# EAGLE design OneButton (EAGLE 8.5.2)
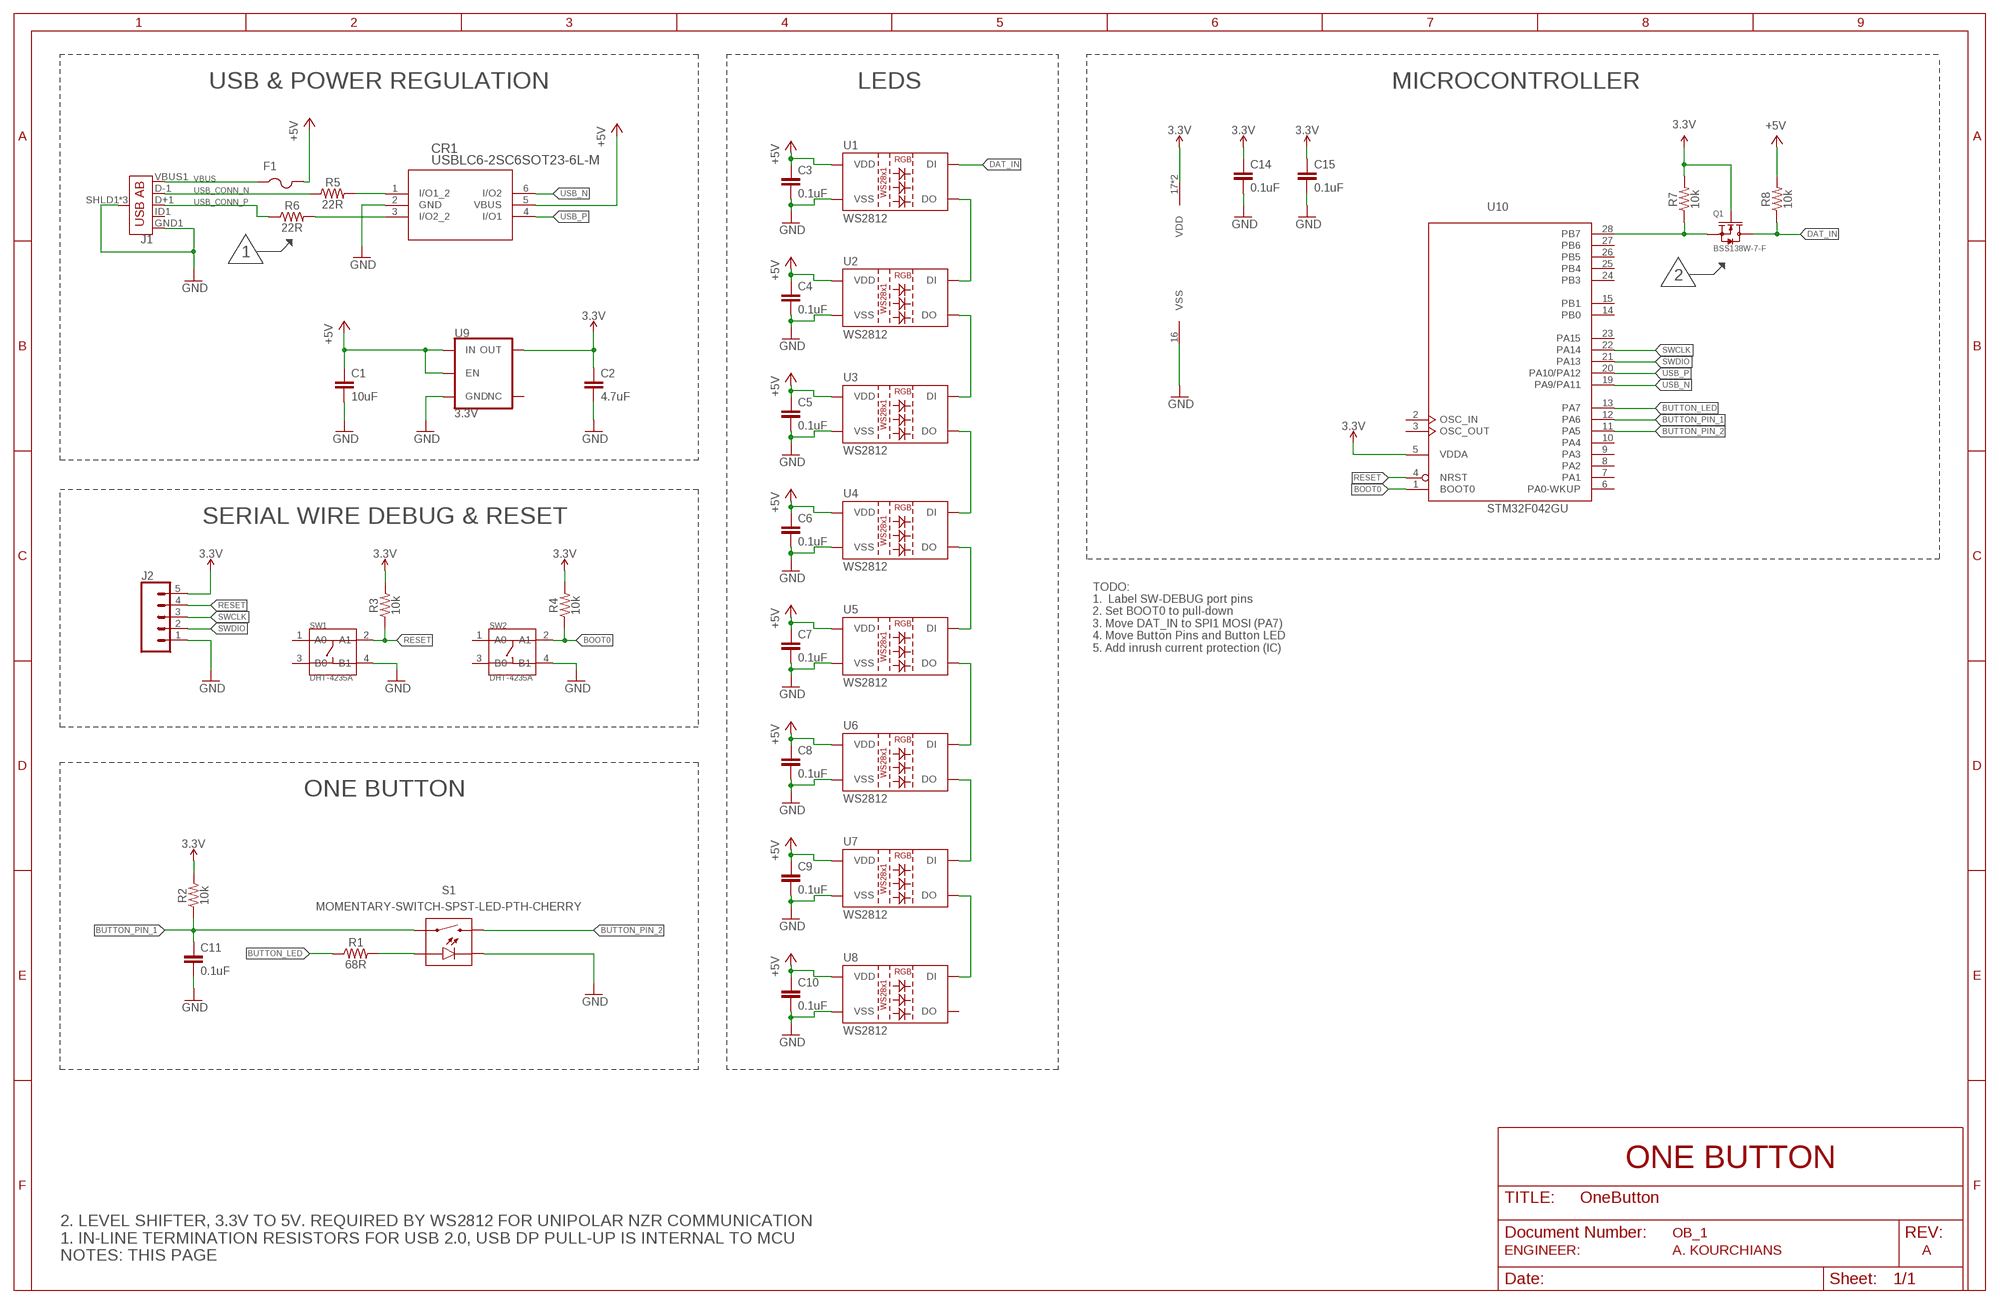
[diagram p0: schematic, sheet 1]

## Parts
C1  10uF  10UFCAP-1206  [CAP-1206]
C2  4.7uF  4.7UFCAP-1206  [CAP-1206]
C3  0.1uF  0.1UFCAP-0603  [CAP-0603]
C4  0.1uF  0.1UFCAP-0603  [CAP-0603]
C5  0.1uF  0.1UFCAP-0603  [CAP-0603]
C6  0.1uF  0.1UFCAP-0603  [CAP-0603]
C7  0.1uF  0.1UFCAP-0603  [CAP-0603]
C8  0.1uF  0.1UFCAP-0603  [CAP-0603]
C9  0.1uF  0.1UFCAP-0603  [CAP-0603]
C10  0.1uF  0.1UFCAP-0603  [CAP-0603]
C11  0.1uF  CAPACITORCAP-0603  [CAP-0603]
C14  0.1uF  0.1UFCAP-0603  [CAP-0603]
C15  0.1uF  0.1UFCAP-0603  [CAP-0603]
CR1  USBLC6-2SC6SOT23-6L-M  [SOT23-6L-M]
F1  PTCFUSE-1206  [R1206]
J1  USB_AB_SMT  [USB-AB-MICRO-SMD]
J2  CONN_05  [1X05]
Q1  BSS138W-7-F  SMD-MOSFET-N-CH-50V-200MA-BSS138W-7-F(SOT-23)  [SOT-23]
R1  68R  RESISTORRES-0603  [RESC0603_N]
R2  10k  RESISTORRES-0603  [RESC0603_N]
R3  10k  RESISTORRES-0603  [RESC0603_N]
R4  10k  RESISTORRES-0603  [RESC0603_N]
R5  22R  RESISTORRES-0603  [RESC0603_N]
R6  22R  RESISTORRES-0603  [RESC0603_N]
R7  10k  RESISTORRES-0603  [RESC0603_N]
R8  10k  RESISTORRES-0603  [RESC0603_N]
S1  MOMENTARY-SWITCH-SPST-LED-PTH-CHERRY  [CHERRY-MX-LED]
SW1  DHT-4235A  SMD-BUTTON-TOP-DHT-4235A(4P-4.2X3.2MM)  [SW4-SMD-4.2X3.2X2.5MM]
SW2  DHT-4235A  SMD-BUTTON-TOP-DHT-4235A(4P-4.2X3.2MM)  [SW4-SMD-4.2X3.2X2.5MM]
U1  WS2812  WS2812"  [LED-TRICOLOR-5050-IC]
U2  WS2812  WS2812"  [LED-TRICOLOR-5050-IC]
U3  WS2812  WS2812"  [LED-TRICOLOR-5050-IC]
U4  WS2812  WS2812"  [LED-TRICOLOR-5050-IC]
U5  WS2812  WS2812"  [LED-TRICOLOR-5050-IC]
U6  WS2812  WS2812"  [LED-TRICOLOR-5050-IC]
U7  WS2812  WS2812"  [LED-TRICOLOR-5050-IC]
U8  WS2812  WS2812"  [LED-TRICOLOR-5050-IC]
U9  3.3V  V_REG_AP2112K-3.3V  [SOT23-5]
U10  STM32F042GU  [UFQFPN28]

## Nets
3.3V: C2.1 C14.1 C15.1 J2.5 Q1.1(G) R2.2 R3.2 R4.2 R7.2 U9.5(OUT) U10.5(VDDA) U10.17(VDD) U10.18(VDD)
+5V: C1.1 C3.1 C4.1 C5.1 C6.1 C7.1 C8.1 C9.1 C10.1 CR1.5(VBUS) F1.2 R8.2 U1.3(VDD) U1.5(VDD) U2.3(VDD) U2.5(VDD) U3.3(VDD) U3.5(VDD) U4.3(VDD) U4.5(VDD) U5.3(VDD) U5.5(VDD) U6.3(VDD) U6.5(VDD) U7.3(VDD) U7.5(VDD) U8.3(VDD) U8.5(VDD) U9.1(IN) U9.3(EN)
BOOT0: R4.1 SW2.2(A1) U10.1(BOOT0)
BUTTON_LED: R1.1 U10.13(PA7)
BUTTON_PIN_1: C11.1 R2.1 S1.S1 U10.12(PA6)
BUTTON_PIN_2: S1.S2 U10.11(PA5)
DAT_IN: Q1.3(D) R8.1 U1.2(DI)
GND: C1.2 C2.2 C3.2 C4.2 C5.2 C6.2 C7.2 C8.2 C9.2 C10.2 C11.2 C14.2 C15.2 CR1.2(GND) J1.GND1(GND) J1.SHLD1(SHIELD) J1.SHLD2(SHIELD) J1.SHLD3(SHIELD) J2.1 S1.K1(C) S1.K(C) SW1.4(B1) SW2.4(B1) U1.6(VSS) U2.6(VSS) U3.6(VSS) U4.6(VSS) U5.6(VSS) U6.6(VSS) U7.6(VSS) U8.6(VSS) U9.2(GND) U10.16(VSS)
N$2: Q1.2(S) R7.1 U10.28(PB7)
N$6: R1.2 S1.A S1.A1(A)
N$9: U1.1(DO) U2.2(DI)
N$10: U2.1(DO) U3.2(DI)
N$11: U3.1(DO) U4.2(DI)
N$12: U4.1(DO) U5.2(DI)
N$13: U5.1(DO) U6.2(DI)
N$14: U6.1(DO) U7.2(DI)
N$15: U7.1(DO) U8.2(DI)
RESET: J2.4 R3.1 SW1.2(A1) U10.4(NRST)
SWCLK: J2.3 U10.22(PA14)
SWDIO: J2.2 U10.21(PA13)
USB_CONN_N: J1.D-1(D-) R5.1
USB_CONN_P: J1.D+1(D+) R6.1
USB_N: CR1.6(I/O2) U10.19(PA9/PA11)
USB_P: CR1.4(I/O1) U10.20(PA10/PA12)
USB_R_N: CR1.1(I/O1_2) R5.2
USB_R_P: CR1.3(I/O2_2) R6.2
VBUS: F1.1 J1.VBUS1(VBUS)
Unconnected: J1.ID1(USBID) SW1.1(A0) SW1.3(B0) SW2.1(A0) SW2.3(B0) U8.1(DO) U9.4(NC) U10.2(OSC_IN) U10.3(OSC_OUT) U10.6(PA0-WKUP) U10.7(PA1) U10.8(PA2) U10.9(PA3) U10.10(PA4) U10.14(PB0) U10.15(PB1) U10.23(PA15) U10.24(PB3) U10.25(PB4) U10.26(PB5) U10.27(PB6)

## Notes on the sheet
- USB & POWER REGULATION | LEDS | MICROCONTROLLER
- 1
- 2
- SERIAL WIRE DEBUG & RESET
- TODO:
  1.  Label SW-DEBUG port pins
  2. Set BOOT0 to pull-down
  3. Move DAT_IN to SPI1 MOSI (PA7)
  4. Move Button Pins and Button LED
  5. Add inrush current protection (IC)
- ONE BUTTON
- ONE BUTTON
- OB_1
- ENGINEER:                       A. KOURCHIANS | A
- 2. LEVEL SHIFTER, 3.3V TO 5V. REQUIRED BY WS2812 FOR UNIPOLAR NZR COMMUNICATION
  1. IN-LINE TERMINATION RESISTORS FOR USB 2.0, USB DP PULL-UP IS INTERNAL TO MCU
  NOTES: THIS PAGE

## Library data of the parts
C1 = OneButton:10UF: 10.0µF ceramic capacitors A capacitor is a passive two-terminal electrical component used to store electrical energy temporarily in an electric field.; MPN: CL31B106KAHNNNE
C2 = OneButton:4.7UF: 4.7µF ceramic capacitors A capacitor is a passive two-terminal electrical component used to store electrical energy temporarily in an electric field.; MPN: C3216X7R1C475K160AB
C3-C10 C14 C15 = OneButton:0.1UF: 0.1µF ceramic capacitors A capacitor is a passive two-terminal electrical component used to store electrical energy temporarily in an electric field.; MPN: C0603C104K8RACTU
C11 = OneButton:CAPACITOR: Generic chip capacitor
CR1 = OneButton:USBLC6-2SC6; MPN: USBLC62SC6; VENDOR: ST Microelectronics
F1 = OneButton:PTCFUSE: PTC fuses, resettable thermistors; MPN: 0ZCJ0075AF2E
J1 = OneButton:USB_AB: USB Type AB Micro Connector OTG-compatible. 5 pins, 3 shield pins SparkFun Products: IOIO-OTG <https://www.sparkfun.com/products/13613> SparkFun SAMD21 Mini Breakout <https://www.sparkfun.com/products/13664>; MPN: 10118192-0001LF; PROD_ID: CONN-11794
J2 = OneButton:CONN_05: Multi connection point. Often used as Generic Header-pin footprint for 0.1 inch spaced/style header connections On any of the 0.1 inch spaced packages, you can populate with these: Break Away Headers - Straight <https://www.sparkfun.com/products/116> (PRT-00116) Break Away Male Headers - Right Angle <https://www.sparkfun.com/products/553> (PRT-00553) Female Headers <https://www.sparkfun.com/products/115> (PRT-00115) Break Away Headers - Machine Pin <https://www.sparkfun.com/products/117> (PRT-00117) Break Away Female Headers - Swiss Machine Pin <https://www.sparkfun.com/products/743> (PRT-00743) For SCREWTERMINALS and SPRING TERMINALS visit here: Screw Terimnals on SparkFun.com <https://www.sparkfun.com/search/results?term=Screw+Terminals> (5mm/3.5mm/2.54mm spacing) This device is also useful as a general connection point to wire up your design to another part of your project. Our various solder wires solder well into these plated through hole pads. Hook-Up Wire - Assortment (Stranded, 22 AWG) <https://www.sparkfun.com/products/11375> (PRT-11375) Hook-Up Wire - Assortment (Solid Core, 22 AWG) <https://www.sparkfun.com/products/11367> (PRT-11367) View the entire wire category on our website here <https://www.sparkfun.com/categories/141> Special notes: Molex polarized connector foot print use with SKU : PRT-08231 with associated crimp pins and housings. 1MM SMD Version SKU: PRT-10208; MPN: 61300511121
Q1 = OneButton:SMD-MOSFET-N-CH-50V-200MA-BSS138W-7-F(SOT-23): SMD-MOSFET-N-CH 305030000; MPN: BSS138LT1G
R1-R8 = OneButton:RESISTOR: Generic Resistor Package
S1 = OneButton:MOMENTARY-SWITCH-SPST-LED: Momentary Switch (Pushbutton) - SPST - w/ LED Normally-open (NO) SPST momentary switches (buttons, pushbuttons), with a built-in LED. Variants PTH-CHERRY - Cherry MX Switch Cherry MX Keyswitches are top-of-the-line mechanical keyboard switches. They’re satisfyingly “clicky”, reliable up to tens-of-millions of key presses, and a standard in gaming and programming keyboards across the globe. This ‘blue’ version Cherry MX Switch is favored by most due to its secondary internal actuator making it less likely to “double-tap.” If you are looking for a noticeably audible and high-quality key switch, this is the perfect option for you! Cherry MX Switch <https://www.sparkfun.com/products/13834> (COM-13834) Cherry MX Switch Breakout <https://www.sparkfun.com/products/13773> (BOB-13773) PTH-12MM and PTH-12MM-KIT - 12mm Illuminated LED KIT variant is for soldering kits. There is no tStop (covering up the top side of the pads with mask). This helps the beginner see which side they should be soldering too. LED Tactile Button Breakout <https://www.sparkfun.com/products/10467> (BOB-10467) LED Tactile Button - Red <https://www.sparkfun.com/products/10442> (COM-10442) LED Tactile Button - Blue <https://www.sparkfun.com/products/10443> (COM-10443) LED Tactile Button - Green <https://www.sparkfun.com/products/10440> (COM-10440) LED Tactile Button - Orange <https://www.sparkfun.com/products/10441> (COM-10441) LED Tactile Button - White <https://www.sparkfun.com/products/10439> (COM-10439); MPN: MX1A-E1NW; SF_ID: COM-13834; SPICEPREFIX: S
SW1 SW2 = OneButton:SMD-BUTTON-TOP-DHT-4235A(4P-4.2X3.2MM): 311020045; MPN: PTS810 SJK 250 SMTR LFS
U1-U8 = OneButton:WS2812: WS2812 RGB LED w/ WS2811 driver 5x5mm SMD LED with built-in controller IC. Color: Red/Green/Blue mC Rating: RGB: 550, 1100, 200 mcd Current:RGB: 20, 20, 20 mA Forward Voltage: RGB: 1.8, 3.0, 3.2 V Packages:LED-TRICOLOR-5050-IC SparkFun Products: LED-SMD RGB (WS2812) <https://www.sparkfun.com/products/11821>; MPN: WS2812; PROD_ID: DIO-11598
U9 = OneButton:V_REG_AP2112: AP2112 - 600mA CMOS LDO Regulator w/ Enable The AP2112 is CMOS process low dropout linear regulator with enable function, the regulator delivers a guaranteed 600mA (min.) continuous load current. Features Output Voltage Accuracy: ±1.5% Output Current: 600mA (Min.) Foldback Short Current Protection: 50mA Enable Function to Turn ON/OFF VOUT Low Dropout Voltage (3.3V): 250mV (Typ.) @IOUT=600mA Excellent Load Regulation: 0.2%/A (Typ.) Excellent Line Regulation: 0.02%/V (Typ.) Low Quiescent Current: 55μA (Typ.) Low Standby Current: 0.01μA (Typ.) Low Output Noise: 50μVRMS PSRR: 100Hz -65dB, 1kHz -65dB OTSD Protection Stable with 1.0μF Flexible Cap: Ceramic, Tantalum and Aluminum Electrolytic Operation Temperature Range: -40°C to 85°C ESD: MM 400V, HBM 4000V; MPN: AP2112K-3.3TRG1; PROD_ID: VREG-12457
U10 = OneButton:STM32F042G*U; MPN: STM32F042G6U6

## Board
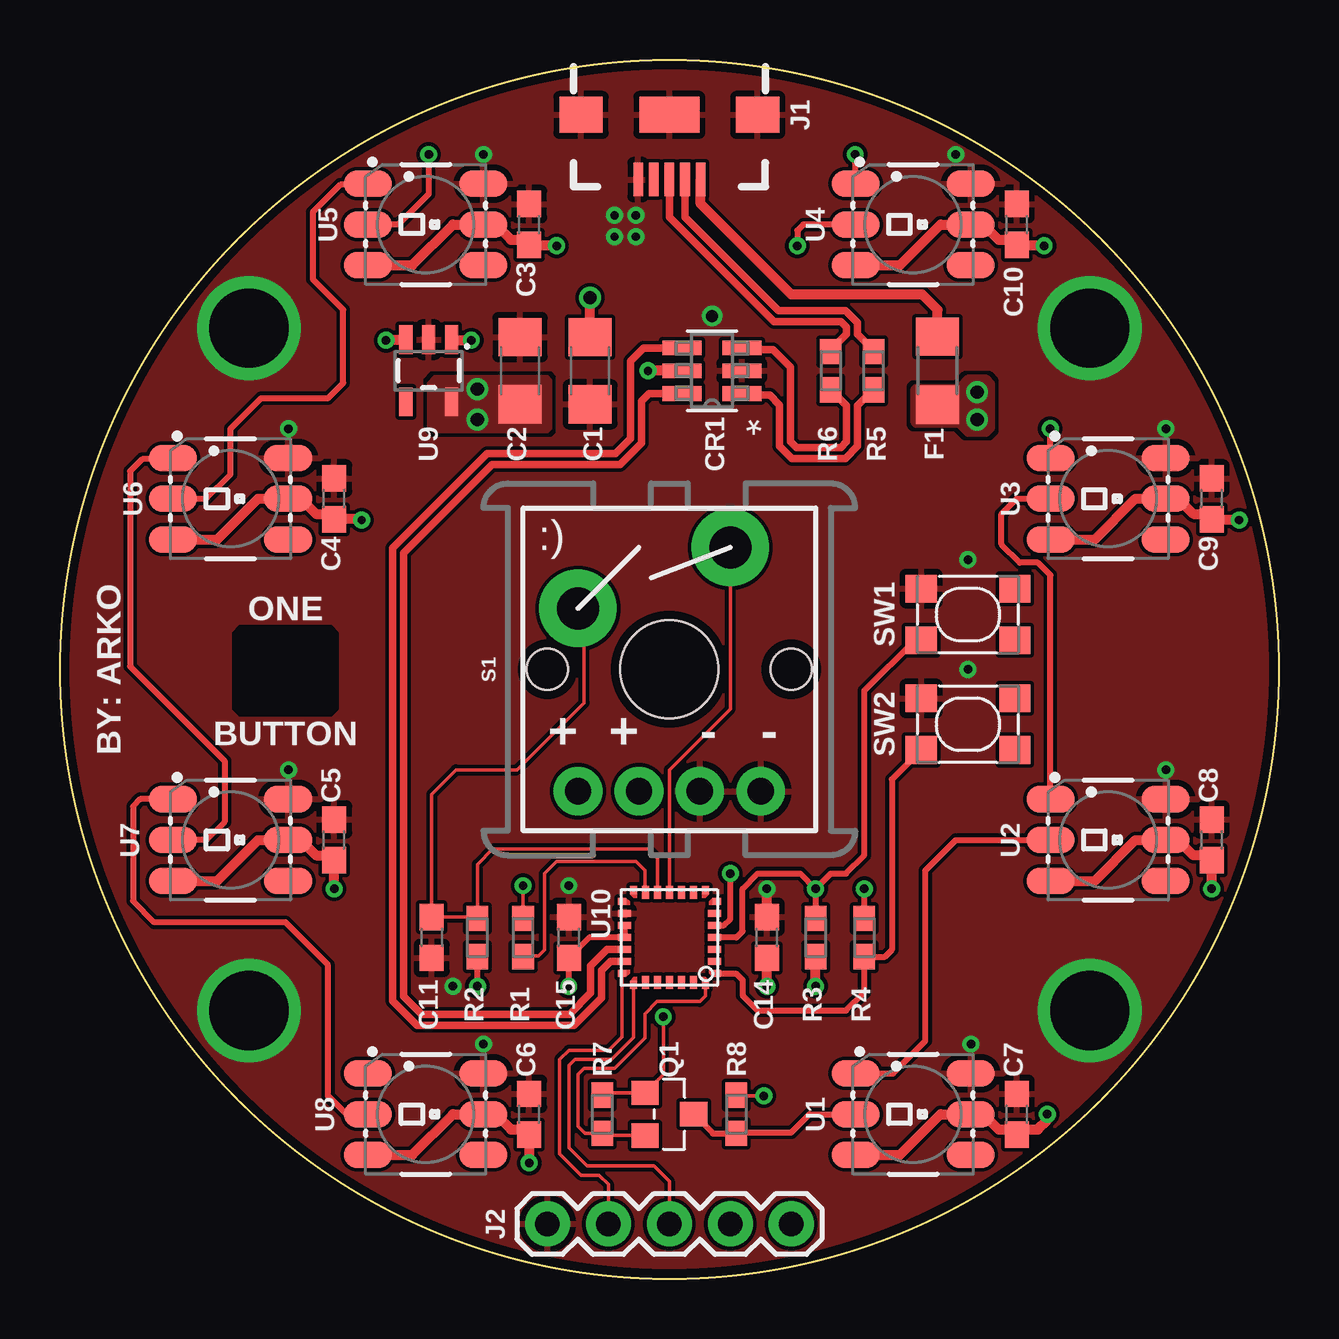
[diagram p1: board, top side]
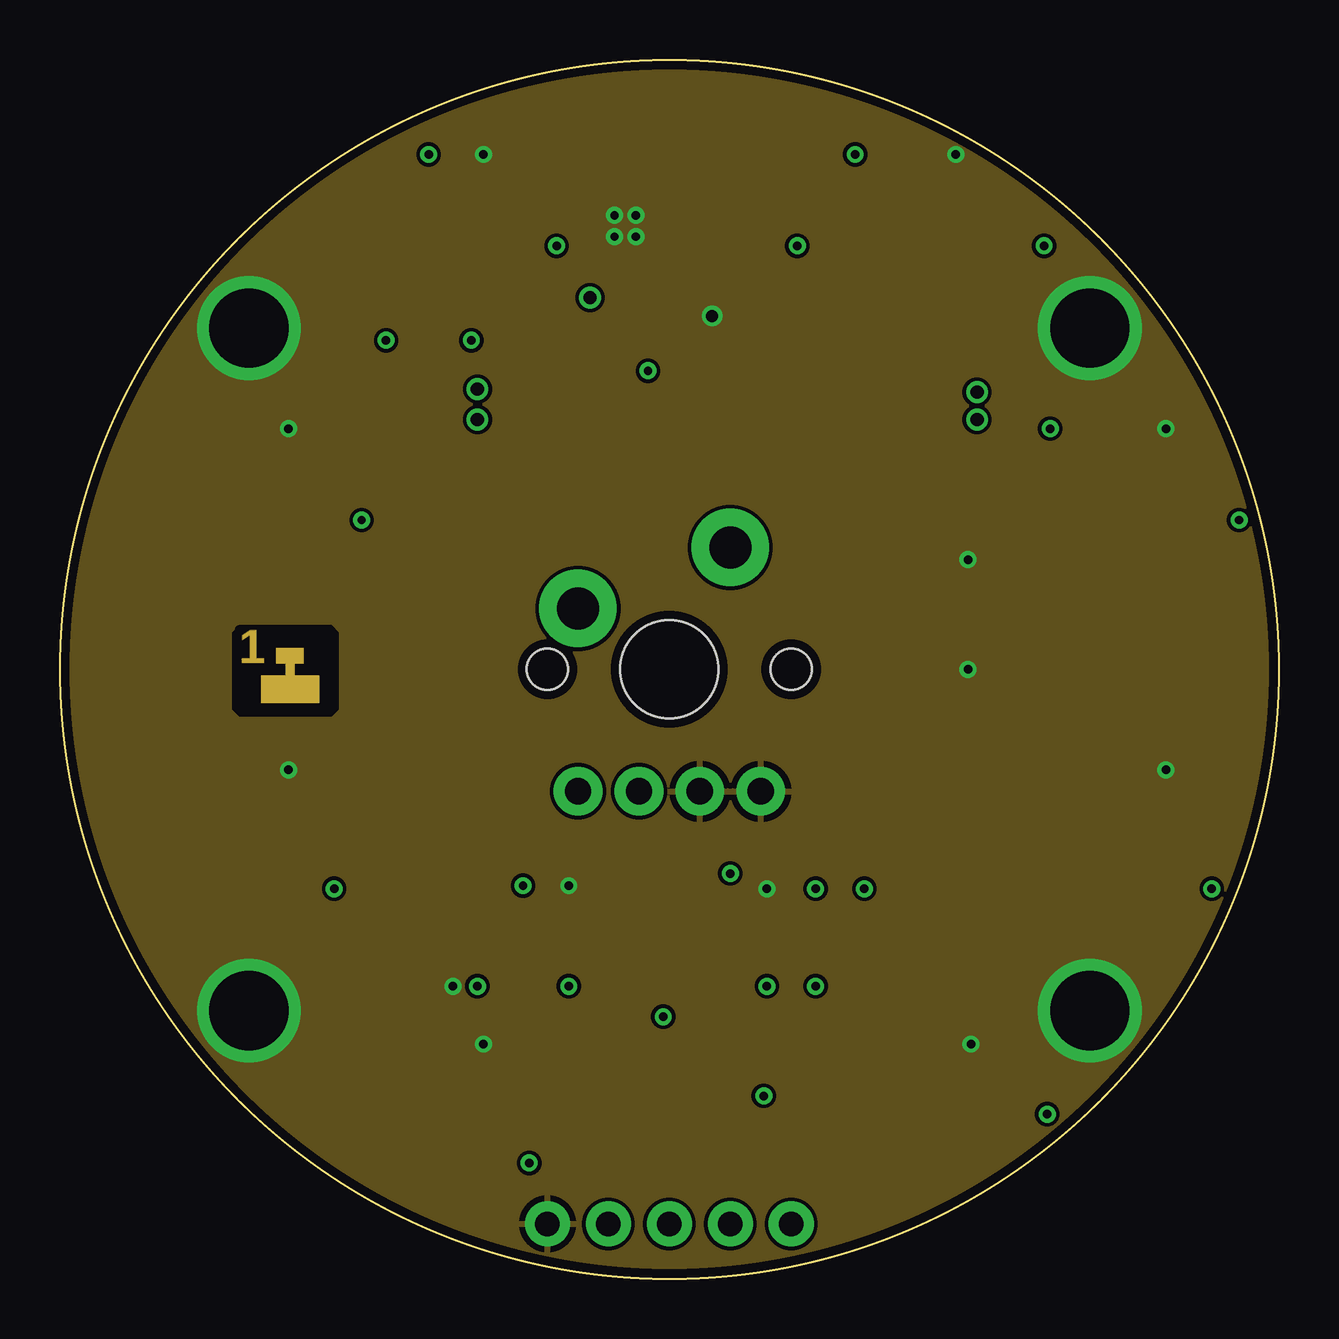
[diagram p2: board, inner layer Route2]
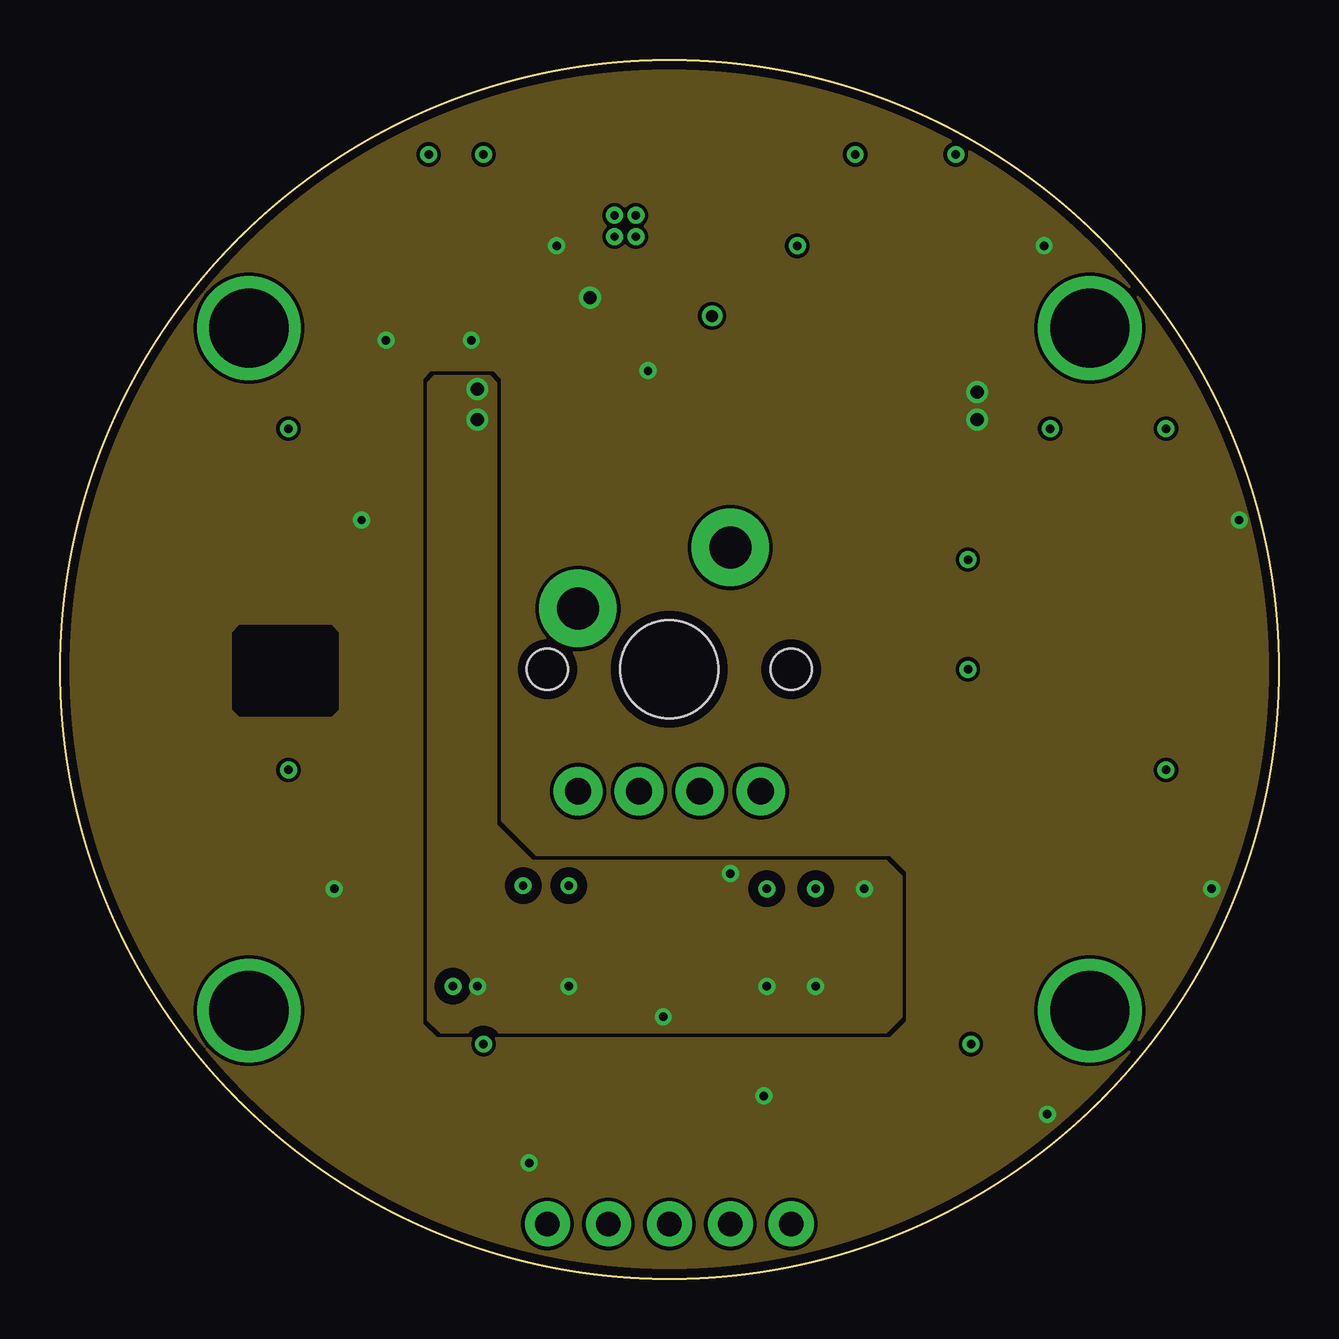
[diagram p3: board, inner layer Route15]
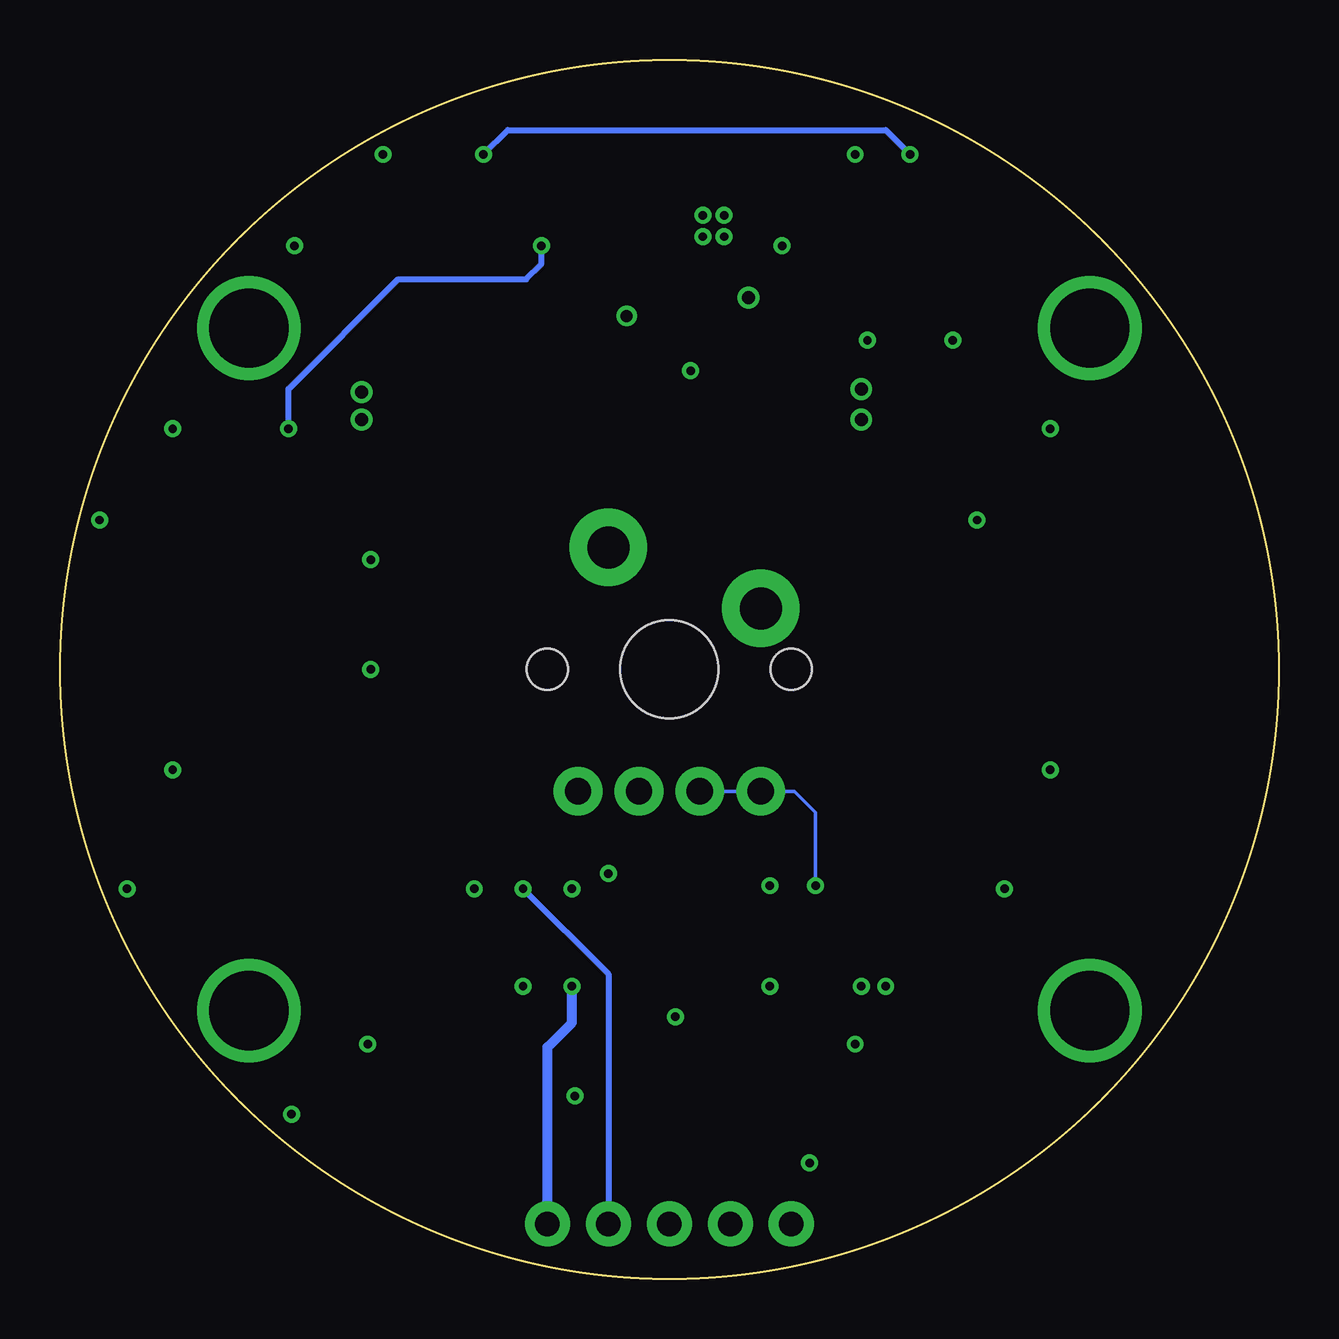
[diagram p4: board, bottom side, seen from below]

Size 50.8 x 50.8 mm. Coordinates in mm from the lower left corner, seen from the top.
Outline: circle at 25.4,25.4 radius 25.4
Copper layers (1*2*15*16): Top 0.035559375mm / dielectric 0.47751875mm / Route2 0.035559375mm / dielectric 0.47751875mm / Route15 0.035559375mm / dielectric 0.47751875mm / Bottom 0.035559375mm
Design rules "4-layer-FAB-LIMIT_6MIL": minimum track width 6mil, minimum drill 13mil, track to track 6mil, track to pad 6mil, pad to pad 6mil, via to via 6mil, smd to smd 6mil, copper to edge 15mil, drill to drill 6mil, minimum pad ring 7mil, minimum via ring 7mil, stop-mask expansion 3mil, vias tented up to drill 0mil, thermal gap 10mil

### Footprints (pad centres in the part's own frame; a part is rotated, then mirrored left to right if it is on the bottom)
CAP-1206 = smd 1.6 x 1.8: 1 -1.4,0; 2 1.4,0
CAP-0603 = smd 1.1 x 1: 1 -0.85,0; 2 0.85,0
SOT23-6L-M = smd 1.626 x 0.61: 1 -1.245,0.95; 2 -1.245,0; 3 -1.245,-0.95; 4 1.245,-0.95; 5 1.245,0; 6 1.245,0.95
R1206 = smd 1.6 x 1.803: 1 -1.422,0; 2 1.422,0
USB-AB-MICRO-SMD = smd 1.4 x 0.4: D+1 2.7,0; D-1 2.7,0.65; GND1 2.7,-1.3; ID1 2.7,-0.65; VBUS1 2.7,1.3 | smd 1.5 x 1.8: SHLD1 0,-3.68; SHLD2 0,3.68 | smd 1.5 x 2.5: SHLD3 0,0
1X05 = drill 1.016 pad 1.88: 1 0,0; 2 2.54,0; 3 5.08,0; 4 7.62,0; 5 10.16,0
SOT-23 = smd 1.016 x 1.143: 1 -0.889,-1.016; 2 0.889,-1.016; 3 0,1.016
RESC0603_N = smd 1.05 x 0.9: 1 -0.8,0; 2 0.8,0
CHERRY-MX-LED = drill 1.092 pad 2.032: A -1.27,-5.08; A1 -3.81,-5.08; K 1.27,-5.08; K1 3.81,-5.08 | drill 1.753 pad 3.226: S1 -3.81,2.54; S2 2.54,5.08 | hole 4.089: 0,0 | hole 1.707: -5.08,0; 5.08,0
SW4-SMD-4.2X3.2X2.5MM = smd 1.3 x 1.15: 1 -1.95,1.075; 2 1.95,1.075; 3 -1.95,-1.075; 4 1.95,-1.075
LED-TRICOLOR-5050-IC = smd 2 x 1.1: 1 -2.4,1.7; 2 -2.4,0; 3 -2.4,-1.7; 4 2.4,-1.7; 5 2.4,0; 6 2.4,1.7
SOT23-5 = smd 0.55 x 1.2: 1 -0.95,-1.3; 2 0,-1.3; 3 0.95,-1.3; 4 0.95,1.3; 5 -0.95,1.3
UFQFPN28 = smd 0.35 x 0.3: 1 -1.975,1.5; 7 -1.975,-1.5; 15 1.975,-1.5; 21 1.975,1.5 | smd 0.55 x 0.3: 2 -1.875,1; 3 -1.875,0.5; 4 -1.875,0; 5 -1.875,-0.5; 6 -1.875,-1; 16 1.875,-1; 17 1.875,-0.5; 18 1.875,0; 19 1.875,0.5; 20 1.875,1 | smd 0.3 x 0.35: 8 -1.5,-1.975; 14 1.5,-1.975; 22 1.5,1.975; 28 -1.5,1.975 | smd 0.3 x 0.55: 9 -1,-1.875; 10 -0.5,-1.875; 11 0,-1.875; 12 0.5,-1.875; 13 1,-1.875; 23 1,1.875; 24 0.5,1.875; 25 0,1.875; 26 -0.5,1.875; 27 -1,1.875

### Placement (x,y rotation side)
C1  22.1,37.85 270 top
C2  19.18,37.85 90 top
C3  19.56,43.94 90 top
C4  11.43,32.51 90 top
C5  11.43,18.29 90 top
C6  19.56,6.86 90 top
C7  39.88,6.86 90 top
C8  48.01,18.29 90 top
C9  48.01,32.51 90 top
C10  39.88,43.94 90 top
C11  15.49,14.22 270 top
C14  29.46,14.22 90 top
C15  21.21,14.22 90 top
CR1  27.18,37.85 180 top
F1  36.58,37.85 270 top
J1  25.4,48.51 270 top
J2  20.32,2.29 0 top
Q1  25.4,6.86 270 top
R1  19.3,14.22 90 top
R2  17.4,14.22 270 top
R3  31.5,14.22 270 top
R4  33.53,14.22 90 top
R5  33.91,37.85 270 top
R6  32.13,37.85 270 top
R7  22.61,6.86 90 top
R8  28.19,6.86 90 top
S1  25.4,25.4 0 top
SW1  37.85,27.69 180 top
SW2  37.85,23.11 180 top
U1  35.56,6.86 0 top
U2  43.69,18.29 0 top
U3  43.69,32.51 0 top
U4  35.56,43.94 0 top
U5  15.24,43.94 0 top
U6  7.11,32.51 0 top
U7  7.11,18.29 0 top
U8  15.24,6.86 0 top
U9  15.37,37.85 180 top
U10  25.4,14.22 180 top

### Tracks (layer width: path | path; a pad name or v marks a point on that pad's centre or on a via)
3.3V  (via drill 0.35, 0.55)
  Top 0.152: R7.2 22.7,7.75 Q1.1 25.15,8.51 v25.15,10.92
  Top 0.254: 23.5,14.22 U10.18 | 23.5,14.22 22.06,14.22 21.25,13.42 | 21.25,13.42 C15.1 | U10.17 23.52,14.25 23.5,14.22 | U10.5 27.28,14.73 27.69,14.73 27.94,14.99 v27.94,16.89 | R3.2 31.53,13.46 | R4.2 v33.53,16.26 | v17.4,12.19 R2.2 | v21.21,12.19 C15.1 | C15.1 21.25,13.42
  Top 0.406: v29.46,12.19 C14.1 | v31.5,12.19 R3.2
  Bottom 0.406: J2.5 30.48,9.65 29.46,10.67 v29.46,12.19
  other vias: 17.4,37.08 17.4,35.81
  pour Top (isolate 0.254, no thermals): 15.62,37.59 20.32,37.59 20.45,37.47 20.45,35.43 20.32,35.31 15.62,35.31 15.37,35.56 15.37,37.34
  pour Route15 (isolate 0.406): 15.62,37.59 17.91,37.59 18.16,37.34 18.16,18.92 19.68,17.4 34.42,17.4 35.05,16.76 35.05,10.92 34.42,10.29 15.88,10.29 15.37,10.79 15.37,37.34
+5V  (via drill 0.35, 0.55)
  Top 0.152: R8.2 28.23,7.62 v29.34,7.62
  Top 0.406: CR1.5 v24.51,37.85 | C1.1 v22.1,40.89 | 36.6,36.45 F1.2 | U8.3 14.68,5.16 16.38,6.86 U8.5 18.16,6.86 18.8,6.22 19.34,6.22 C6.1 v19.56,4.83 | U1.3 35,5.16 36.7,6.86 U1.5 38.48,6.86 39.12,6.22 39.66,6.22 C7.1 40.09,6.22 40.77,6.22 41.15,6.6 v41.15,6.86 | U2.3 43.13,16.59 44.83,18.29 U2.5 46.61,18.29 47.24,17.65 47.79,17.65 C8.1 v48.01,16.26 | U3.3 43.13,30.81 44.83,32.51 U3.5 46.61,32.51 47.24,31.88 47.79,31.88 C9.1 48.05,31.62 v49.15,31.62 | U4.3 35,42.24 36.7,43.94 U4.5 38.48,43.94 39.12,43.31 39.66,43.31 C10.1 39.92,43.05 v41.02,43.05 | U5.3 14.68,42.24 16.38,43.94 U5.5 18.16,43.94 18.8,43.31 19.34,43.31 C3.1 19.6,43.05 v20.7,43.05 | U6.3 6.55,30.81 8.26,32.51 U6.5 10.03,32.51 10.67,31.88 11.21,31.88 C4.1 12.53,31.66 v12.57,31.62 | U7.3 6.55,16.59 8.26,18.29 U7.5 10.03,18.29 10.67,17.65 11.21,17.65 C5.1 v11.43,16.26 | U9.3 14.39,39.12 v13.59,39.12 | U9.1 16.35,39.12 v17.14,39.12
  other vias: 38.23,36.96 38.23,35.81
  pour Route15 (rank 6): -0.51,-0.51 -0.51,51.31 51.31,51.31 51.31,-0.51
  pour Top (isolate 0.406, no thermals): 35.69,37.21 37.47,37.21 37.85,37.59 38.61,37.59 38.86,37.34 38.86,35.43 38.61,35.18 37.85,35.18 37.47,35.56 35.69,35.56 35.56,35.69 35.56,37.08
BOOT0
  Top 0.254: U10.1 28.17,12.72 28.45,12.45 28.45,11.81 29.08,11.18 32.77,11.18 33.53,11.94 R4.1 34.38,13.42 34.67,13.72 34.67,20.81 SW2.2
BUTTON_LED
  Top 0.152: U10.13 24.38,16.11 24.38,17.02 24,17.4 20.7,17.4 20.19,16.89 20.19,13.72 19.94,13.46 19.34,13.46 R1.1
BUTTON_PIN_1
  Top 0.152: U10.12 24.9,17.52 24.51,17.91 18.03,17.91 17.4,17.27 17.4,15.11 | 17.4,15.11 R2.1 | 17.4,15.11 17.36,15.07 C11.1 15.49,20.19 16.51,21.21 19.05,21.21 21.84,24 21.84,27.69 S1.S1
BUTTON_PIN_2
  Top 0.152: U10.11 25.4,21.21 27.94,23.75 S1.S2
DAT_IN
  Top 0.254: Q1.3 27.22,6.06 R8.1 28.23,6.1 30.48,6.1 31.24,6.86 U1.2
GND  (via drill 0.35, 0.5, 3.3)
  Top 0.406: C14.2 v29.46,16.26
  other vias: 27.18,40.13 7.87,39.62 42.93,39.62 42.93,11.18 7.87,11.18 21.21,16.38 17.65,9.78 37.97,9.78 46.1,21.21 46.1,35.43 37.34,46.86 17.65,46.86 9.53,35.43 9.53,21.21 16.38,12.19 37.85,25.4 37.85,29.97 24,44.32 23.11,44.32 23.11,43.43 24,43.43
  pour Route2 (rank 6): -0.51,-0.51 -0.51,51.31 51.31,51.31 51.31,-0.51
  pour Top (rank 6): -0.51,-0.51 -0.51,51.31 51.31,51.31 51.31,-0.51
N$1
  cutout Top (no thermals): 7.49,27.18 11.3,27.18 11.56,26.92 11.56,23.75 11.3,23.5 7.49,23.5 7.24,23.75 7.24,26.92
N$2
  Top 0.152: Q1.2 22.7,5.97 R7.1 21.88,6.06 21.59,6.35 21.59,8.51 21.84,8.76 23.11,8.76 24.38,10.03 24.38,11.05 24.89,11.56 26.67,11.56 26.9,11.79 U10.28
N$3
  cutout Route2 (rank 5, no thermals): 7.49,27.18 11.3,27.18 11.56,26.92 11.56,23.75 11.3,23.5 7.49,23.5 7.24,23.75 7.24,26.92
N$4
  cutout Route15 (no thermals): 7.49,27.18 11.3,27.18 11.56,26.92 11.56,23.75 11.3,23.5 7.49,23.5 7.24,23.75 7.24,26.92
N$5
  cutout Bottom (no thermals): 7.49,27.18 11.3,27.18 11.56,26.92 11.56,23.75 11.3,23.5 7.49,23.5 7.24,23.75 7.24,26.92
N$6  (via drill 0.35)
  Top 0.152: R1.2 v19.3,16.38
  Bottom 0.152: v19.3,16.38 19.3,19.43 20.19,20.32 S1.A1 S1.A
N$9
  Top 0.254: U1.1 34.72,8.56 36.07,9.91 36.07,17.02 37.34,18.29 U2.2
N$10
  Top 0.254: U3.2 39.88,32.51 39.24,31.88 39.24,30.61 40.01,29.84 40.77,29.84 41.29,29.32 U2.1
N$11  (via drill 0.35)
  Top 0.254: U3.1 41.27,34.23 v41.27,35.43 | U4.2 30.99,43.94 30.73,43.69 v30.73,43.05
  Bottom 0.254: v41.27,35.43 41.27,37.08 36.7,41.66 31.37,41.66 30.73,42.29 v30.73,43.05 | v30.73,43.05 30.73,43.18 v30.73,43.05
N$12  (via drill 0.35)
  Top 0.254: U4.1 v33.16,46.85 v33.15,46.86 | v15.37,46.86 15.37,45.21 14.1,43.94 U5.2
  Bottom 0.254: v33.15,46.86 32.13,47.88 16.38,47.88 v15.37,46.86
N$13
  Top 0.254: U6.2 6.1,32.51 7.11,33.53 7.11,35.43 8.38,36.7 11.18,36.7 11.81,37.34 11.81,40.39 10.54,41.66 10.54,44.45 11.68,45.59 12.79,45.59 U5.1
N$14
  Top 0.254: U6.1 4.66,34.16 3.43,34.16 2.92,33.66 2.92,25.53 6.86,21.59 6.86,19.05 6.1,18.29 U7.2
N$15
  Top 0.254: U7.1 3.35,19.99 3.05,19.68 3.05,15.75 3.94,14.86 9.4,14.86 11.18,13.08 11.18,7.62 11.94,6.86 U8.2
RESET  (via drill 0.35)
  Top 0.254: U10.4 28.19,14.22 28.45,14.48 28.45,16.26 29.08,16.89 30.86,16.89 v31.5,16.26 | v31.5,16.26 R3.1 | v31.5,16.26 32.13,16.89 32.77,16.89 33.53,17.65 33.53,24.51 35.63,26.61 SW1.2
  Bottom 0.254: v31.5,16.26 27.94,12.7 J2.4
SWCLK
  Top 0.152: U10.22 23.9,10.06 22.99,9.14 21.46,9.14 21.21,8.89 21.21,5.46 21.97,4.7 24.77,4.7 25.4,4.06 J2.3
SWDIO
  Top 0.152: U10.21 23.43,10.09 22.86,9.53 21.21,9.53 20.83,9.14 20.83,5.21 21.72,4.32 22.48,4.32 22.86,3.94 J2.2
USB_CONN_N
  Top 0.305: J1.D-1 26.05,44.25 29.94,40.36 32.73,40.36 33.25,39.85 33.25,39.37 33.91,38.71 R5.1
USB_CONN_P
  Top 0.305: J1.D+1 25.4,44.25 29.75,39.9 32.54,39.9 32.79,39.66 32.79,39.37 32.13,38.71 R6.1
USB_N
  Top 0.305: U10.19 22.8,13.72 22.12,13.05 22.12,11.91 21.24,11.02 15.08,11.02 14.33,11.78 14.33,30.26 18,33.93 23.34,33.93 24.23,34.83 24.23,36.58 24.55,36.9 CR1.6
USB_P
  Top 0.305: U10.20 22.95,13.22 22.58,12.86 22.58,11.72 21.43,10.57 14.89,10.57 13.87,11.59 13.87,30.45 17.81,34.39 23.15,34.39 23.77,35.02 23.77,38.25 24.32,38.8 CR1.4
USB_R_N
  Top 0.305: CR1.1 28.49,36.83 29.59,36.83 30,36.42 30,34.7 30.51,34.19 32.73,34.19 33.25,34.7 33.25,36.39 R5.2
USB_R_P
  Top 0.305: CR1.3 28.48,38.73 29.72,38.73 30.45,38 30.45,34.89 30.7,34.65 32.54,34.65 32.79,34.89 32.79,36.39 R6.2
VBUS
  Top 0.406: F1.1 36.58,40.39 35.94,41.02 30.48,41.02 26.7,44.8 J1.VBUS1
(copper drawn outside any net)
  shapes: Route2 area x3

### Text on the board
Route2: 1
tNames: :) | ONE | BY: ARKO | BUTTON